# Altium schematic sheet 780-00041, rev2, Front Panel, Mirror Cell Controller.SchDoc
size B; PageSetup: Record=PageOptions|CenterHorizontal=True|CenterVertical=True|PrintScale=0.70|XCorrection=1.00|YCorrection=1.00|PrintKind=0|BorderSize=5000000|LeftOffset=0|BottomOffset=0|Orientation=2|PaperLength=1000|PaperWidth=1000|Scale=100|PaperSource=7|PrintQuality=-4|MediaType=1|DitherType=10|PaperKind=Tabloid 11 x 17in|PrintScaleMode=1
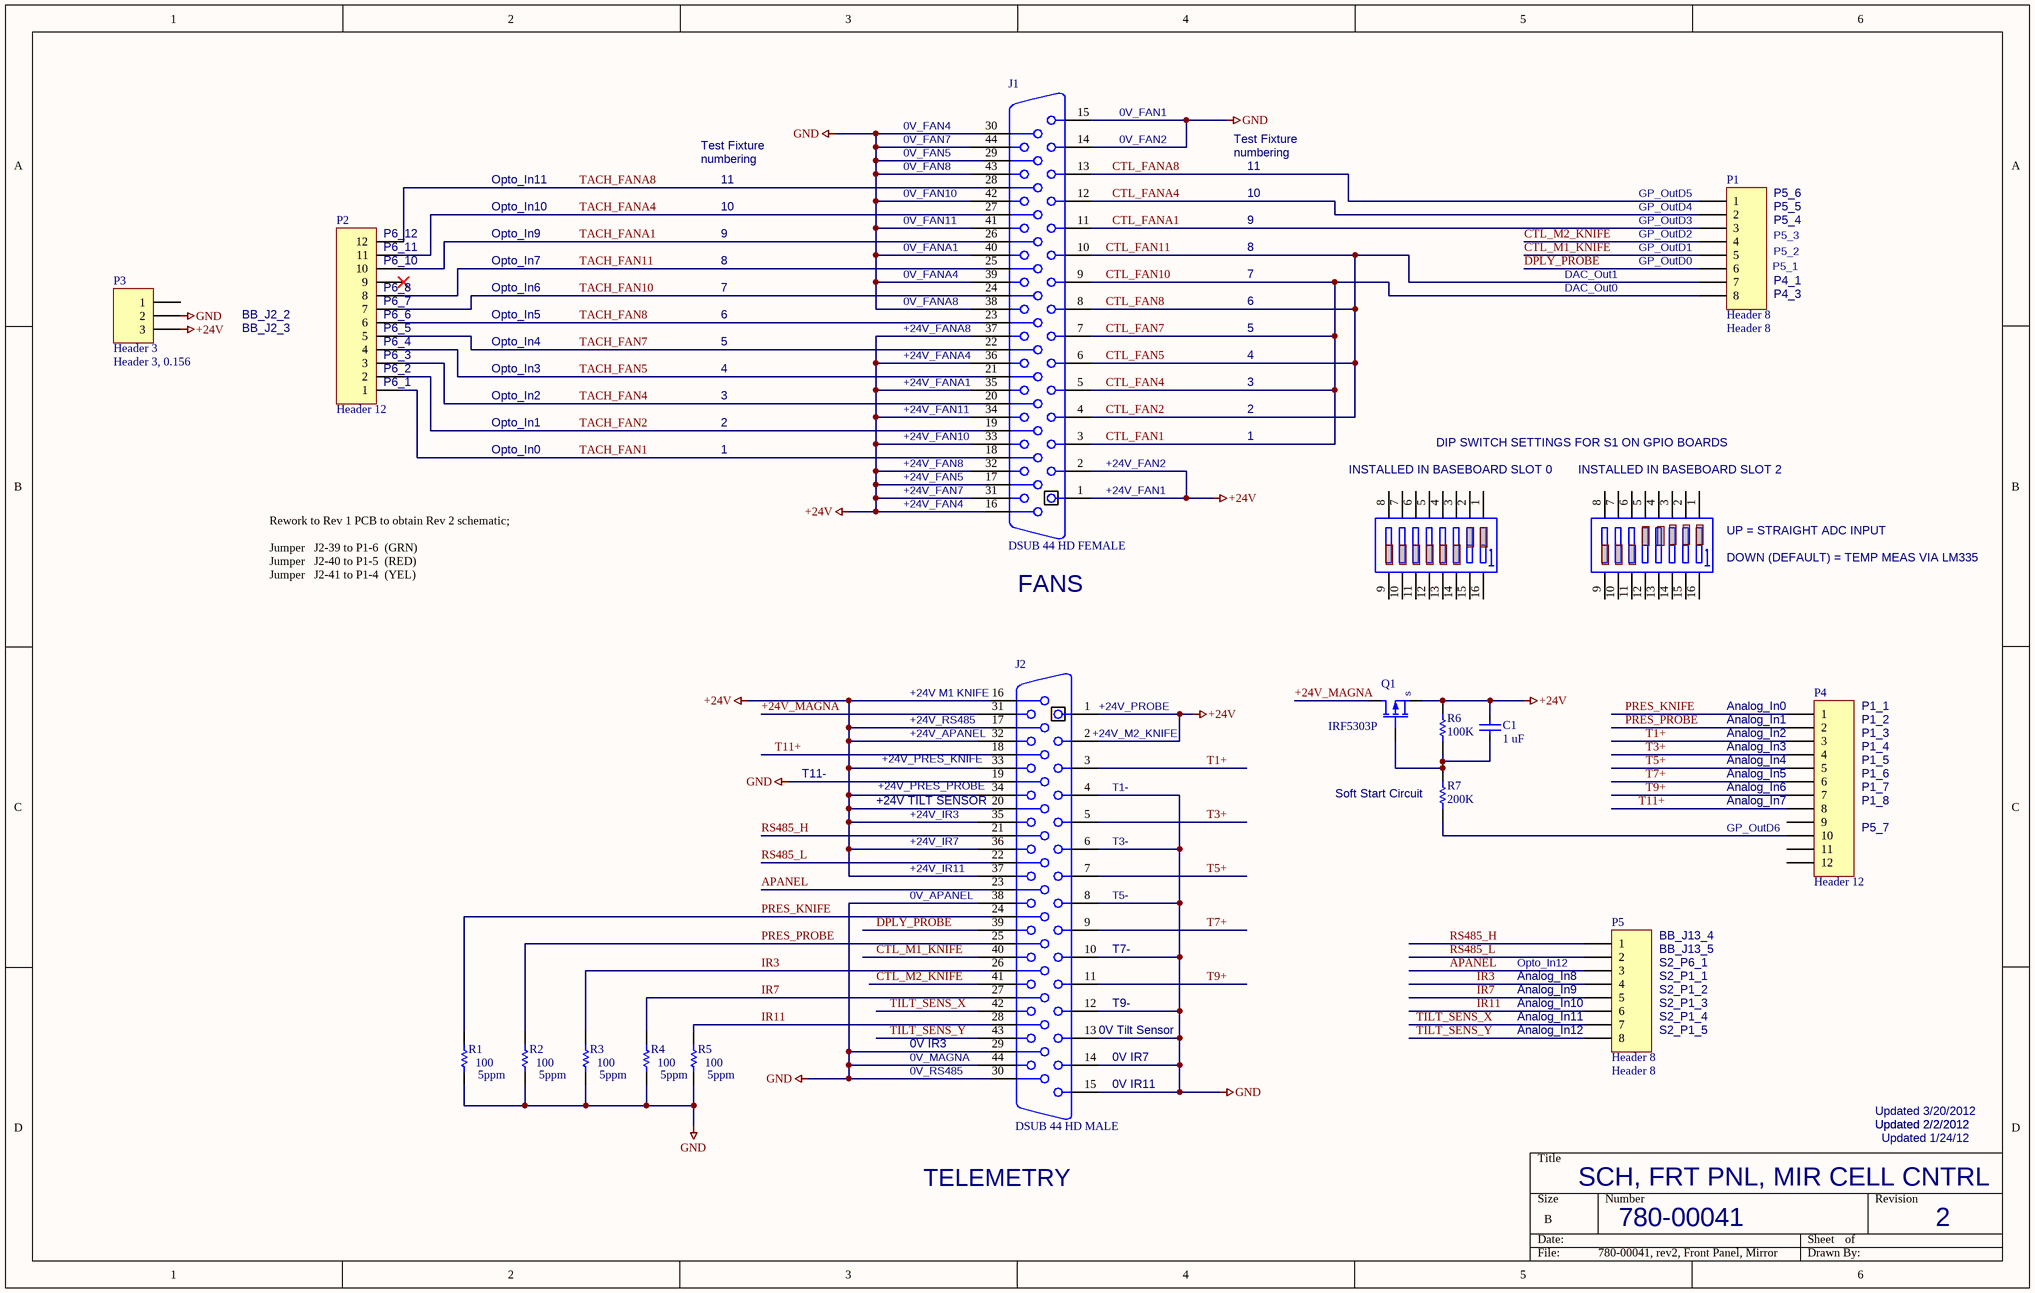
[diagram p0: 780-00041, rev2, Front Panel, Mirror Cell Controller.SchDoc]

## Parts
C1  value 1 uF  [SMD_0805]  (hidden comment: Cap SMD)
J1  DSUB 44 HD FEMALE  [CONN DB44 HD FEM SOCKETS PCB]
J2  DSUB 44 HD MALE  [CONN DB44 HD MALE PINS PCB]
P1  Header 8  [HDR1X8 for IDC]
P2  Header 12  [HDR1X12 for IDC]
P3  Header 3  value Header 3, 0.156  [HDR 1X3 0.156"]
P4  Header 12  [HDR1X12 for IDC]
P5  Header 8  [HDR1X8 for IDC]
Q1  IRF5303P  [TO-252(D-PAK)  PowerPAD]
R1  5ppm  value 100  [SMD_0805]
R2  5ppm  value 100  [SMD_0805]
R3  5ppm  value 100  [SMD_0805]
R4  5ppm  value 100  [SMD_0805]
R5  5ppm  value 100  [SMD_0805]
R6  value 100K  [SMD_0805]  (hidden comment: Res 0805)
R7  value 200K  [SMD_0805]  (hidden comment: Res 0805)
S100  SW DIP-8  [DIP_SW_8WAY_SMD]  (value not drawn)
S101  SW DIP-8  [DIP_SW_8WAY_SMD]  (value not drawn)

## Nets
+24V: C1.2 J1.1 J1.2 J1.16 J1.17 J1.31 J1.32 J1.33 J1.34 J1.35 J1.36 J1.37 J2.1 J2.2 J2.16 J2.17 J2.20 J2.32 J2.33 J2.34 J2.35 J2.36 J2.37 P3.3 Q1.3(S) R6.2
GND: J1.14 J1.15 J1.29 J1.30 J1.38 J1.39 J1.40 J1.41 J1.42 J1.43 J1.44 J2.4 J2.6 J2.8 J2.10 J2.12 J2.13 J2.14 J2.15 J2.19 J2.29 J2.30 J2.38 J2.44 P3.2 R1.1 R2.1 R3.1 R4.1 R5.1
+24V_MAGNA: J2.31 Q1.2(D)
APANEL: J2.23 P5.3
CTL_FAN1: J1.3 J1.5 J1.7 J1.9 P1.8  [also labelled CTL_FAN10, CTL_FAN4, CTL_FAN7]
CTL_FAN11: J1.4 J1.6 J1.8 J1.10 P1.7  [also labelled CTL_FAN2, CTL_FAN5, CTL_FAN8]
CTL_FANA1: J1.11 P1.3
CTL_FANA4: J1.12 P1.2
CTL_FANA8: J1.13 P1.1
CTL_M1_KNIFE: J2.40 P1.5
CTL_M2_KNIFE: J2.41 P1.4
DPLY_PROBE: J2.39 P1.6
IR3: J2.26 P5.4 R3.2
IR7: J2.27 P5.5 R4.2
IR11: J2.28 P5.6 R5.2
PRES_KNIFE: J2.24 P4.1 R1.2
PRES_PROBE: J2.25 P4.2 R2.2
RS485_H: J2.21 P5.1
RS485_L: J2.22 P5.2
T1+: J2.3 P4.3
T3+: J2.5 P4.4
T5+: J2.7 P4.5
T7+: J2.9 P4.6
T9+: J2.11 P4.7
T11+: J2.18 P4.8
TACH_FAN1: J1.18 P2.1
TACH_FAN2: J1.19 P2.2
TACH_FAN4: J1.20 P2.3
TACH_FAN5: J1.21 P2.4
TACH_FAN7: J1.22 P2.5
TACH_FAN8: J1.23 P2.6
TACH_FAN10: J1.24 P2.7
TACH_FAN11: J1.25 P2.8
TACH_FANA1: J1.26 P2.10
TACH_FANA4: J1.27 P2.11
TACH_FANA8: J1.28 P2.12
TILT_SENS_X: J2.42 P5.7
TILT_SENS_Y: J2.43 P5.8
NetC1_1: C1.1 Q1.1(G) R6.1 R7.2
NetP4_10: P4.10 R7.1

Not connected (* = marked no-connect by the designer): P2 9*; P3 1; P4 9 11 12; S100 1(A1) 2(A2) 3(A3) 4(A4) 5(A5) 6(A6) 7(A7) 8(A8) 9(B8) 10(B7) 11(B6) 12(B5) 13(B4) 14(B3) 15(B2) 16(B1); S101 1(A1) 2(A2) 3(A3) 4(A4) 5(A5) 6(A6) 7(A7) 8(A8) 9(B8) 10(B7) 11(B6) 12(B5) 13(B4) 14(B3) 15(B2) 16(B1)

## Notes on the sheet
- Test Fixture
- numbering
- 0V_FAN4
- 0V_FAN5
- 0V_FAN7
- 0V_FAN1
- 0V_FAN2
- (near P2) P6_12
- Opto_In9
- Opto_In10
- Opto_In11
- 9
- 10
- 11
- 0V_FAN8
- 0V_FAN10
- 0V_FAN11
- (near P1) GP_OutD3
- (near P1) GP_OutD4
- (near P1) GP_OutD5
- (near P1) GP_OutD2
- (near P1) P5_4
- (near P1) P5_5
- (near P1) P5_6
- (near P2) P6_8
- (near P2) P6_10
- (near P2) P6_11
- Opto_In6
- Opto_In7
- 7
- 8
- 0V_FANA1
- 0V_FANA4
- DAC_Out0
- DAC_Out1
- (near P1) GP_OutD0
- (near P1) GP_OutD1
- (near P1) P5_1
- (near P1) P4_1
- (near P1) P4_3
- (near P1) P5_2
- (near P1) P5_3
- BB_J2_2
- BB_J2_3
- (near P2) P6_2
- (near P2) P6_3
- (near P2) P6_4
- (near P2) P6_5
- (near P2) P6_6
- (near P2) P6_7
- Opto_In3
- Opto_In4
- Opto_In5
- 4
- 5
- 6
- (near J1) +24V_FANA4
- (near J1) +24V_FANA8
- 0V_FANA8
- (near P2) P6_1
- Opto_In1
- Opto_In2
- 2
- 3
- (near J1) +24V_FAN11
- (near J1) +24V_FANA1
- Opto_In0
- 1
- +24V_FAN4
- +24V_FAN5
- +24V_FAN7
- +24V_FAN8
- (near J1) +24V_FAN10
- (near J1) +24V_FAN1
- (near J1) +24V_FAN2
- (near S100) INSTALLED IN BASEBOARD SLOT 0
- DIP SWITCH SETTINGS FOR S1 ON GPIO BOARDS
- (near S101) INSTALLED IN BASEBOARD SLOT 2
- (near S101) UP = STRAIGHT ADC INPUT
- (near S101) DOWN (DEFAULT) = TEMP MEAS VIA LM335
- FANS
- Rework to Rev 1 PCB to obtain Rev 2 schematic;
  Jumper   J2-39 to P1-6  (GRN)
  Jumper   J2-40 to P1-5  (RED)
  Jumper   J2-41 to P1-4  (YEL)
- (near J2) +24V M1 KNIFE
- T11-
- +24V_PRES_KNIFE
- (near J2) +24V_RS485
- (near J2) +24V_APANEL
- (near J2) +24V_M2_KNIFE
- (near J2) +24V_PROBE
- (near P4) Analog_In0
- (near P4) Analog_In1
- (near P4) Analog_In2
- (near P4) Analog_In3
- (near P4) Analog_In4
- (near P4) Analog_In5
- (near P4) P1_1
- (near P4) P1_2
- (near P4) P1_3
- (near P4) P1_4
- (near P4) P1_5
- (near P4) P1_6
- (near J2) +24V TILT SENSOR
- +24V_PRES_PROBE
- +24V_IR3
- (near J2) T1-
- (near R7) Soft Start Circuit
- (near P4) Analog_In6
- (near P4) Analog_In7
- (near P4) GP_OutD6
- (near P4) P1_7
- (near P4) P1_8
- (near P4) P5_7
- +24V_IR7
- +24V_IR11
- 0V_APANEL
- (near J2) T3-
- (near J2) T5-
- (near J2) T7-
- (near P5) Opto_In12
- (near P5) S2_P6_1
- (near P5) BB_J13_4
- (near P5) BB_J13_5
- 0V IR3
- (near J2) 0V Tilt Sensor
- (near J2) T9-
- (near P5) Analog_In8
- (near P5) Analog_In9
- (near P5) Analog_In10
- (near P5) Analog_In11
- (near P5) Analog_In12
- (near P5) S2_P1_1
- (near P5) S2_P1_2
- (near P5) S2_P1_3
- (near P5) S2_P1_4
- (near P5) S2_P1_5
- 0V_RS485
- 0V_MAGNA
- (near J2) 0V IR7
- (near J2) 0V IR11
- Updated 2/2/2012
- Updated 3/20/2012
- Updated 1/24/12
- TELEMETRY
- SCH, FRT PNL, MIR CELL CNTRL
- 780-00041
- (in symbol IRF5303P) s

## Library data of the parts
C1 = Cap SMD: Capacitor; LCO p/n: 120-00006
J1 = DSUB 44 HD FEMALE: Receptacle Assembly, 44 PIN; Manufacturer: fci; Manuf p/n: 10090929-S444XLF; LCO p/n: 125-00126; Vendor: digi-key; Vendor p/n: 609-4035-ND
J2 = DSUB 44 HD MALE: Receptacle Assembly, 44 PIN; Manufacturer: FCI; Manuf p/n: 10090928-P444XLF; LCO p/n: 125-00127; Vendor: Digi-Key; Vendor p/n: 609-4030-ND
P1 P5 = Header 8: Header, 8-Pin; Manufacturer: tyco; Manuf p/n: 640456-8; Vendor: digi-key; Vendor p/n: A1924-ND; LCO p/n: 125-00047; VALUE: Header 8
P2 P4 = Header 12: Header, 12-Pin; Manufacturer: Tyco; Manuf p/n: 1-640456-2; Vendor: Digi-Key; Vendor p/n: A19475-ND; LCO p/n: 125-00055; COST: 0.57; VALUE: Header 12
P3 = Header 3, 0.156: Header, 3-Pin, 0.156; LCO p/n: 125-00083
Q1 = IRF5303P: P-Chan MOSFET; Manufacturer: INT'l Rectifier; Manuf p/n: IRFR5305TRPBF; LCO p/n: 150-00093; Vendor: Digi-Key; Vendor Mult.: 1; Vendor p/n: IRFR5305PBFCT-ND; VALUE: IRF5303P
R1-R5 = Res SMD: Resistor 0805; Manufacturer: Vishay/Dale; Manuf p/n: TNPU0805100RBZEN00; Vendor: DIGIKEY; Vendor p/n: TNP100BBCT-ND; Vendor Mult.: 10; LCO p/n: 180-00078; COST: 0.09
R6 = Res SMD: Resistor 0805; Manufacturer: Vishay/Dale; Manuf p/n: CRCW0805100KFKEA; Vendor: DIGIKEY; Vendor p/n: 541-100KCCT-ND; Vendor Mult.: 10; LCO p/n: 181-01003; COST: 0.09
R7 = Res SMD: Resistor 0805; Manufacturer: Vishay/Dale; Manuf p/n: CRCW0805200KFKEA; Vendor: DIGIKEY; Vendor p/n: 541-200KCCT-ND; Vendor Mult.: 10; LCO p/n: 181-02003; COST: 0.09
S100 S101 = SW DIP-8: DIP Switch, 8 Position, SPST; Published: 24-Mar-1999; LatestRevisionDate: 17-Jul-2002; LatestRevisionNote: Re-released for DXP Platform.; PackageReference: DIP_SW_8WAY_SMD; Publisher: Altium Limited; PackageDescription: DIP Switch; 16 Leads